# Altium schematic sheet core.SchDoc
size A4
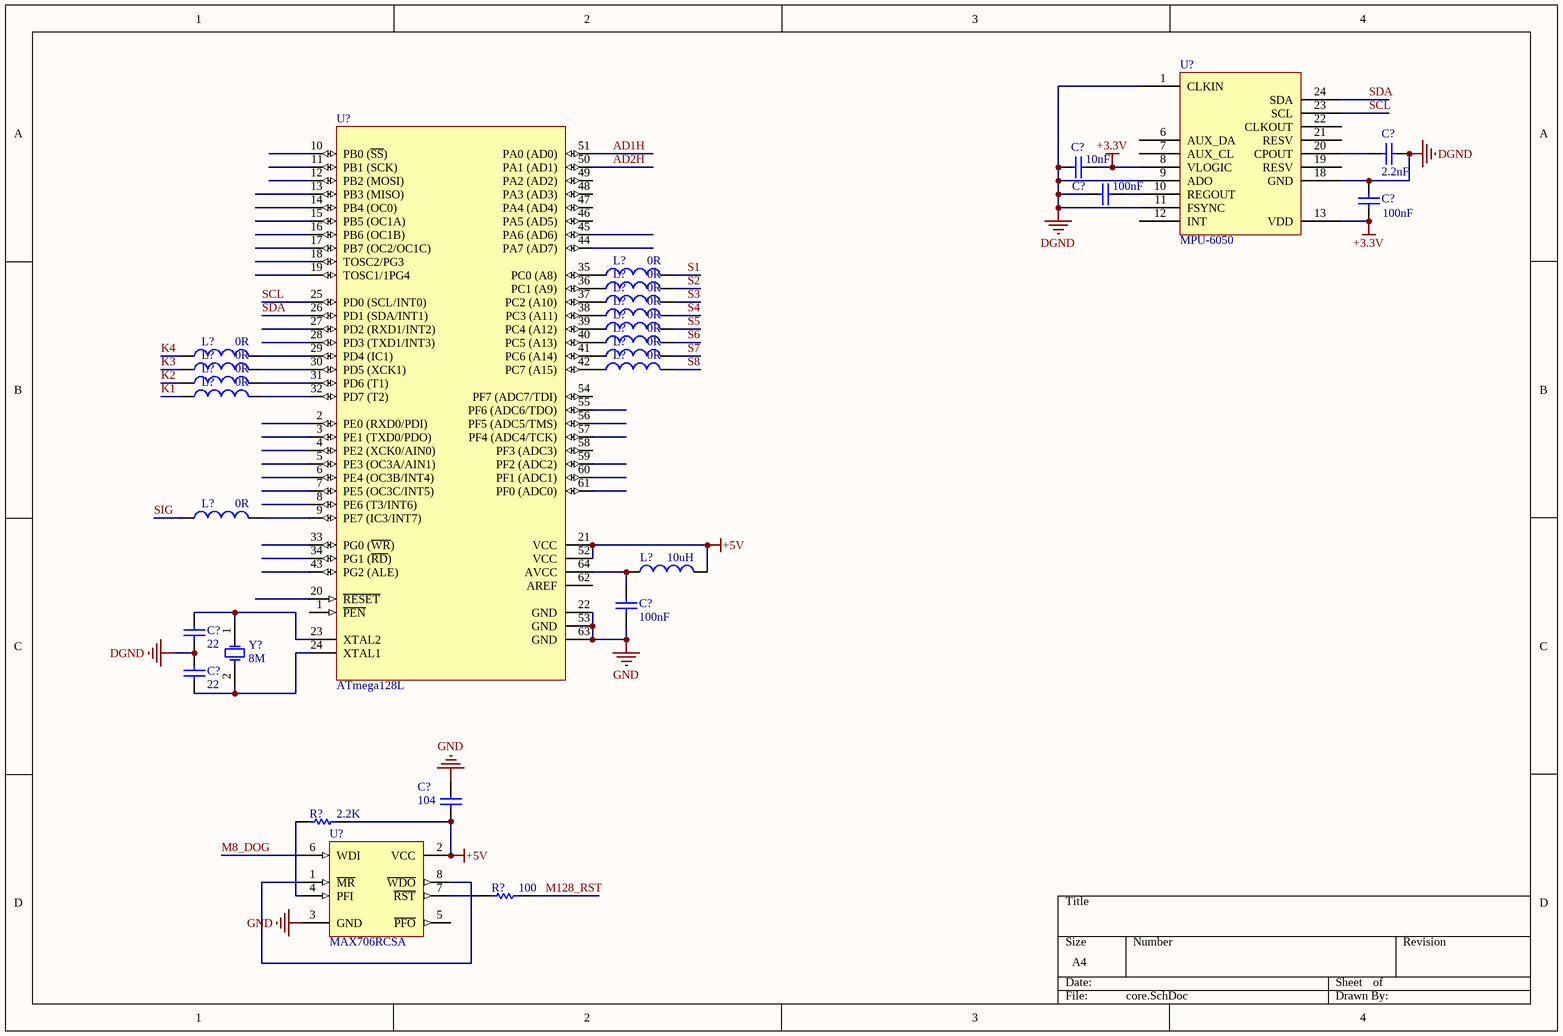
[diagram p0: core.SchDoc]

## Parts
(Parts that share a designator on the sheet are numbered #1, #2 ... from top to bottom, then left to right.)
C?#1  value 10nF  [0603]  (hidden comment: Cap)
C?#2  value 2.2nF  [0603]  (hidden comment: Cap)
C?#3  value 100nF  [0603]  (hidden comment: Cap)
C?#4  value 100nF  [0603]  (hidden comment: Cap)
C?#5  value 100nF  [0603]  (hidden comment: Cap)
C?#6  value 22  [0603]  (hidden comment: Cap)
C?#7  value 22  [0603]  (hidden comment: Cap)
C?#8  value 104  [0603]  (hidden comment: Cap)
L?#1  value 0R  [0603]  (hidden comment: Inductor)
L?#2  value 0R  [0603]  (hidden comment: Inductor)
L?#3  value 0R  [0603]  (hidden comment: Inductor)
L?#4  value 0R  [0603]  (hidden comment: Inductor)
L?#5  value 0R  [0603]  (hidden comment: Inductor)
L?#6  value 0R  [0603]  (hidden comment: Inductor)
L?#7  value 0R  [0603]  (hidden comment: Inductor)
L?#8  value 0R  [0603]  (hidden comment: Inductor)
L?#9  value 0R  [0603]  (hidden comment: Inductor)
L?#10  value 0R  [0603]  (hidden comment: Inductor)
L?#11  value 0R  [0603]  (hidden comment: Inductor)
L?#12  value 0R  [0603]  (hidden comment: Inductor)
L?#13  value 0R  [0603]  (hidden comment: Inductor)
L?#14  value 10uH  [0603]  (hidden comment: Inductor)
R?#1  value 2.2K  [0603]  (hidden comment: Res1)
R?#2  value 100  [0603]  (hidden comment: Res1)
U?#1  value ATmega128L  [64A_N]  (hidden comment: IC)
U?#2  value MPU-6050  [QFN50P400X400X95-24N]  (hidden comment: GYRO)
U?#3  MAX706RCSA  [SOIC8]
Y?  value 8M  [49SD]  (hidden comment: XTAL)

## Nets
+3.3V: C?#1.2 C?#4.1 U?#2.8(VLOGIC) U?#2.13(VDD)
+5V: C?#8.2 L?#14.2 R?#1.2 U?#1.21(VCC) U?#1.52(VCC) U?#3.2(VCC)
DGND: C?#1.1 C?#2.1 C?#3.2 C?#4.2 C?#6.1 C?#7.2 U?#2.1(CLKIN) U?#2.9(ADO) U?#2.11(FSYNC) U?#2.18(GND)
GND: C?#5.1 C?#8.1 U?#1.22(GND) U?#1.53(GND) U?#1.63(GND) U?#3.3(GND)
AD1H: U?#1.51(PA0_(AD0))
AD2H: U?#1.50(PA1_(AD1))
K1: L?#12.1
K2: L?#11.1
K3: L?#9.1
K4: L?#7.1
M8_DOG: U?#3.6(WDI)
M128_RST: R?#2.2
S1: L?#1.2
S2: L?#2.2
S3: L?#3.2
S4: L?#4.2
S5: L?#5.2
S6: L?#6.2
S7: L?#8.2
S8: L?#10.2
SCL: U?#1.25(PD0_(SCL/INT0)) U?#2.23(SCL)
SDA: U?#1.26(PD1_(SDA/INT1)) U?#2.24(SDA)
SIG: L?#13.1
NetC?#2_2: C?#2.2 U?#2.20(CPOUT)
NetC?#3_1: C?#3.1 U?#2.10(REGOUT)
NetC?#5_2: C?#5.2 L?#14.1 U?#1.64(AVCC)
NetC?#6_2: C?#6.2 U?#1.23(XTAL2) Y?.1(OSC1)
NetC?#7_1: C?#7.1 U?#1.24(XTAL1) Y?.2(OSC2)
NetL?#1_1: L?#1.1 U?#1.35(PC0_(A8))
NetL?#2_1: L?#2.1 U?#1.36(PC1_(A9))
NetL?#3_1: L?#3.1 U?#1.37(PC2_(A10))
NetL?#4_1: L?#4.1 U?#1.38(PC3_(A11))
NetL?#5_1: L?#5.1 U?#1.39(PC4_(A12))
NetL?#6_1: L?#6.1 U?#1.40(PC5_(A13))
NetL?#7_2: L?#7.2 U?#1.29(PD4_(IC1))
NetL?#8_1: L?#8.1 U?#1.41(PC6_(A14))
NetL?#9_2: L?#9.2 U?#1.30(PD5_(XCK1))
NetL?#10_1: L?#10.1 U?#1.42(PC7_(A15))
NetL?#11_2: L?#11.2 U?#1.31(PD6_(T1))
NetL?#12_2: L?#12.2 U?#1.32(PD7_(T2))
NetL?#13_2: L?#13.2 U?#1.9(PE7_(IC3/INT7))
NetR?#1_1: R?#1.1 U?#3.4(PFI)
NetR?#2_1: R?#2.1 U?#3.7(~{RST})
NetU?#3_1: U?#3.1(~{MR}) U?#3.8(~{WDO})

Not connected (* = marked no-connect by the designer): U?#1 1(~{PEN}) 2(PE0_(RXD0/PDI)) 3(PE1_(TXD0/PDO)) 4(PE2_(XCK0/AIN0)) 5(PE3_(OC3A/AIN1)) 6(PE4_(OC3B/INT4)) 7(PE5_(OC3C/INT5)) 8(PE6_(T3/INT6)) 10(PB0_(~{SS})) 11(PB1_(SCK)) 12(PB2_(MOSI)) 13(PB3_(MISO)) 14(PB4_(OC0)) 15(PB5_(OC1A)) 16(PB6_(OC1B)) 17(PB7_(OC2/OC1C)) 18(TOSC2/PG3) 19(TOSC1/1PG4) 20(~{RESET}) 27(PD2_(RXD1/INT2)) 28(PD3_(TXD1/INT3)) 33(PG0_(~{WR})) 34(PG1_(~{RD})) 43(PG2_(ALE)) 44(PA7_(AD7)) 45(PA6_(AD6)) 46(PA5_(AD5)) 47(PA4_(AD4)) 48(PA3_(AD3)) 49(PA2_(AD2)) 54(PF7_(ADC7/TDI)) 55(PF6_(ADC6/TDO)) 56(PF5_(ADC5/TMS)) 57(PF4_(ADC4/TCK)) 58(PF3_(ADC3)) 59(PF2_(ADC2)) 60(PF1_(ADC1)) 61(PF0_(ADC0)) 62(AREF); U?#2 6(AUX_DA) 7(AUX_CL) 12(INT) 19(RESV) 21(RESV) 22(CLKOUT); U?#3 5(~{PFO})

## Library data of the parts
C?#1-C?#8 = Cap: Capacitor; Published: 8-Jun-2000; LatestRevisionDate: 17-Jul-2002; LatestRevisionNote: Re-released for DXP Platform.; PackageReference: RAD-0.3; Publisher: Altium Limited
L?#1-L?#14 = Inductor: Code_IEC: 1005; Published: 8-Jun-2000; LatestRevisionDate: 17-Jul-2002; LatestRevisionNote: Re-released for DXP Platform.; PackageReference: 0402-A; Publisher: Altium Limited; Code_JEITA: 0402
R?#1 R?#2 = Res1: Resistor; Published: 8-Jun-2000; LatestRevisionDate: 17-Jul-2002; LatestRevisionNote: Re-released for DXP Platform.; PackageReference: AXIAL-0.3; Publisher: Altium Limited
U?#1 = ATmega128L-8AI: 8-Bit AVR Microcontroller with 128K Bytes of In-System Programmable Flash Memory; Published: 17-Sep-2003; LatestRevisionDate: 13-Apr-2006; LatestRevisionNote: IPC-7351 Footprint Added.; DatasheetVersion: 2467G-AVR-09/02; PackageVersion: revB, Oct-2001; PackageReference: 64A; Publisher: Altium Limited; PackageDescription: 64-Pin Thin Quad Flat Pack 0.8 mm Pitch; Code_JEDEC: MS-026-AEB; ComponentLink1Description: Manufacturer Link; ComponentLink1URL: http://www.atmel.com; ComponentLink2Description: Datasheet; ComponentLink2URL: http://www.atmel.com/dyn/resources/prod_documents/doc2467.pdf
U?#2 = MPU-6000
U?#3 = MAX706RCSA: +3V Voltage Monitoring, Low-Cost, µP Supervisory Circuit; Published: 16-Jan-2001; LatestRevisionDate: 13-Apr-2006; LatestRevisionNote: IPC-7351 Footprint Added.; DatasheetVersion: Sep-1995; PackageReference: NSO8; Publisher: Altium Limited; PackageDescription: 8-Pin Small Outline Integrated Circuit 1.27 mm Pitch; Code_JEDEC: MS-012-AA; Code_IPC: SOIC127P600-8; ComponentLink1Description: Manufacturer Link; ComponentLink1URL: http://www.maxim-ic.com/; ComponentLink2Description: Datasheet; ComponentLink2URL: http://pdfserv.maxim-ic.com/en/ds/MAX706P-MAX708T.pdf
Y? = XTAL: Crystal Oscillator; Published: 8-Jun-2000; LatestRevisionDate: 17-Jul-2002; LatestRevisionNote: Re-released for DXP Platform.; PackageReference: R38; Publisher: Altium Limited